# Altium schematic sheet 19_PWR_VRS.SchDoc
size A3; DocumentNumber: 19; SheetNumber: 19; SheetTotal: 21
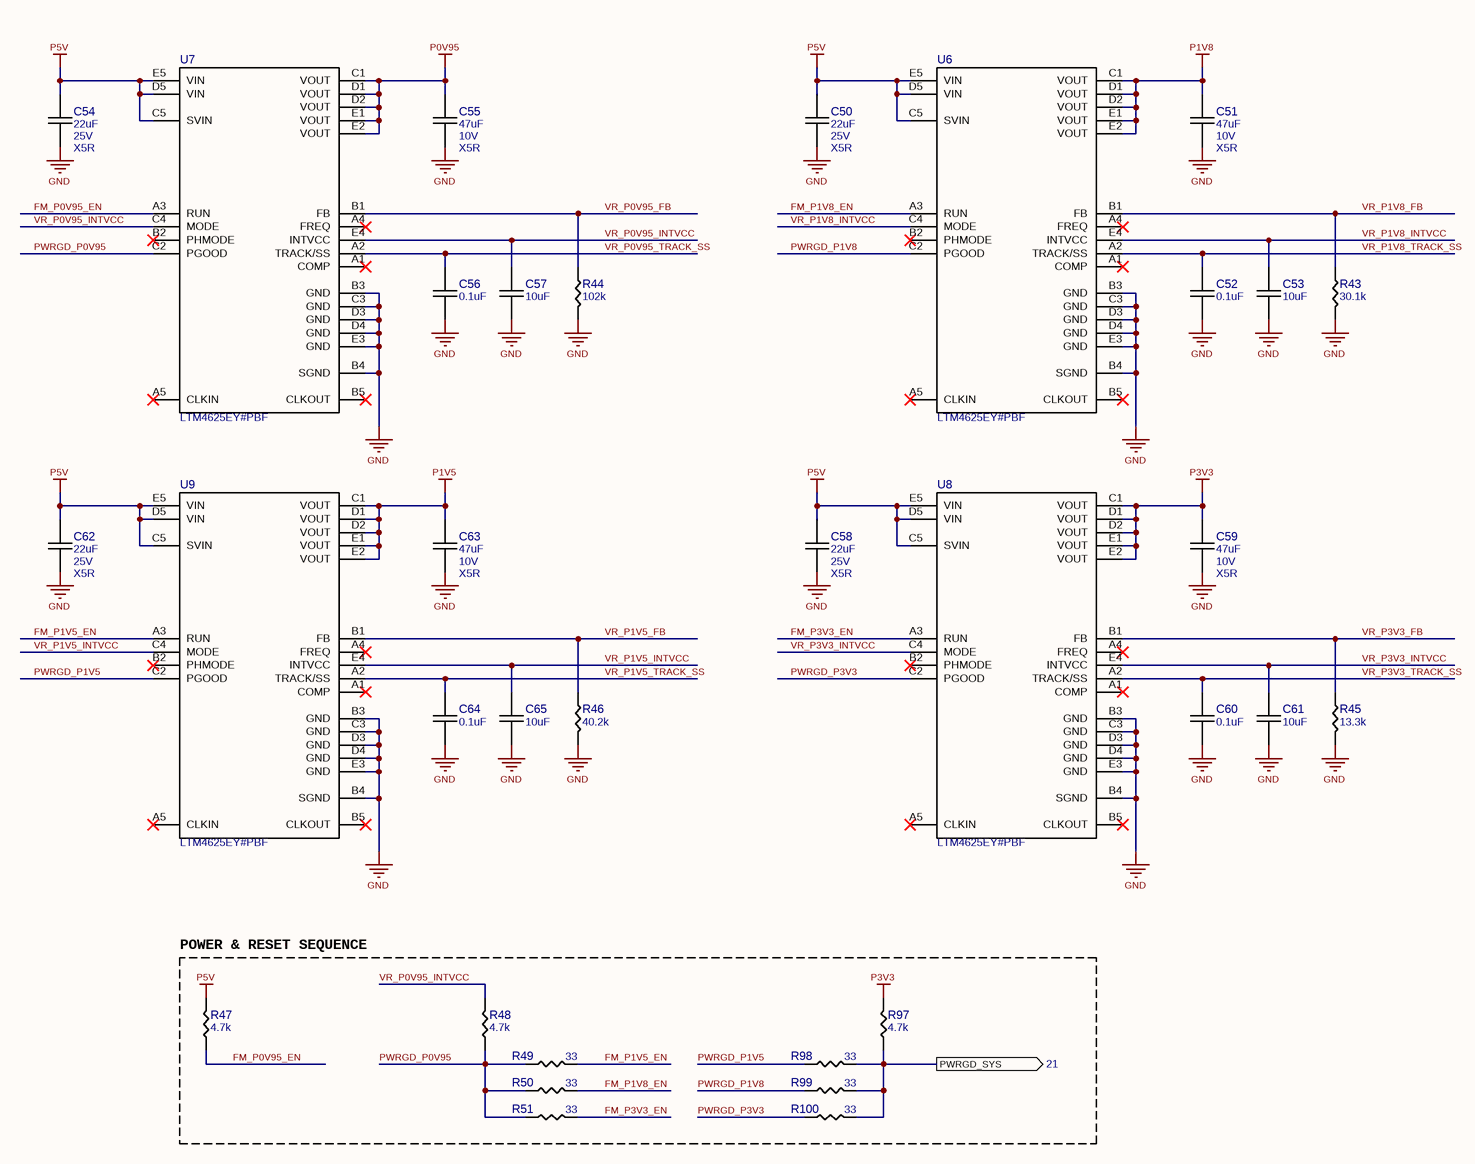
[diagram p0: 19_PWR_VRS.SchDoc]

## Parts
C50  22uF  Voltage: 25V  TempC: X5R  [CAPC2012X14N]
C51  47uF  Voltage: 10V  TempC: X5R  [CAPC2012X14N]
C52  0.1uF  [CAPC1005X06N]
C53  10uF  [CAPC1005X06N]
C54  22uF  Voltage: 25V  TempC: X5R  [CAPC2012X14N]
C55  47uF  Voltage: 10V  TempC: X5R  [CAPC2012X14N]
C56  0.1uF  [CAPC1005X06N]
C57  10uF  [CAPC1005X06N]
C58  22uF  Voltage: 25V  TempC: X5R  [CAPC2012X14N]
C59  47uF  Voltage: 10V  TempC: X5R  [CAPC2012X14N]
C60  0.1uF  [CAPC1005X06N]
C61  10uF  [CAPC1005X06N]
C62  22uF  Voltage: 25V  TempC: X5R  [CAPC2012X14N]
C63  47uF  Voltage: 10V  TempC: X5R  [CAPC2012X14N]
C64  0.1uF  [CAPC1005X06N]
C65  10uF  [CAPC1005X06N]
R43  30.1k  [RESC1005X03N]
R44  102k  [RESC1005X03N]
R45  13.3k  [RESC1005X03N]
R46  40.2k  [RESC1005X03N]
R47  4.7k  [RESC1005X03N]
R48  4.7k  [RESC1005X03N]
R49  33  [RESC1005X03N]
R50  33  [RESC1005X03N]
R51  33  [RESC1005X03N]
R97  4.7k  [RESC1005X03N]
R98  33  [RESC1005X03N]
R99  33  [RESC1005X03N]
R100  33  [RESC1005X03N]
U6  LTM4625EY#PBF  [BGA25C127P5X5_625X625X521]
U7  LTM4625EY#PBF  [BGA25C127P5X5_625X625X521]
U8  LTM4625EY#PBF  [BGA25C127P5X5_625X625X521]
U9  LTM4625EY#PBF  [BGA25C127P5X5_625X625X521]

## Blocks framed on the sheet
POWER & RESET SEQUENCE: R47-R51 R97-R100

## Ports
PWRGD_SYS (out, see 21)

## Nets
GND: C50.1 C51.1 C52.1 C53.1 C54.1 C55.1 C56.1 C57.1 C58.1 C59.1 C60.1 C61.1 C62.1 C63.1 C64.1 C65.1 R43.2 R44.2 R45.2 R46.2 U6.B3(GND) U6.B4(SGND) U6.C3(GND) U6.D3(GND) U6.D4(GND) U6.E3(GND) U7.B3(GND) U7.B4(SGND) U7.C3(GND) U7.D3(GND) U7.D4(GND) U7.E3(GND) U8.B3(GND) U8.B4(SGND) U8.C3(GND) U8.D3(GND) U8.D4(GND) U8.E3(GND) U9.B3(GND) U9.B4(SGND) U9.C3(GND) U9.D3(GND) U9.D4(GND) U9.E3(GND)
P0V95: C55.2 U7.C1(VOUT) U7.D1(VOUT) U7.D2(VOUT) U7.E1(VOUT) U7.E2(VOUT)
P1V5: C63.2 U9.C1(VOUT) U9.D1(VOUT) U9.D2(VOUT) U9.E1(VOUT) U9.E2(VOUT)
P1V8: C51.2 U6.C1(VOUT) U6.D1(VOUT) U6.D2(VOUT) U6.E1(VOUT) U6.E2(VOUT)
P3V3: C59.2 R97.2 U8.C1(VOUT) U8.D1(VOUT) U8.D2(VOUT) U8.E1(VOUT) U8.E2(VOUT)
P5V: C50.2 C54.2 C58.2 C62.2 R47.2 U6.C5(SVIN) U6.D5(VIN) U6.E5(VIN) U7.C5(SVIN) U7.D5(VIN) U7.E5(VIN) U8.C5(SVIN) U8.D5(VIN) U8.E5(VIN) U9.C5(SVIN) U9.D5(VIN) U9.E5(VIN)
FM_P0V95_EN: R47.1 U7.A3(RUN)
FM_P1V5_EN: R49.2 U9.A3(RUN)
FM_P1V8_EN: R50.2 U6.A3(RUN)
FM_P3V3_EN: R51.2 U8.A3(RUN)
PWRGD_P0V95: R48.1 R49.1 R50.1 R51.1 U7.C2(PGOOD)
PWRGD_P1V5: R98.1 U9.C2(PGOOD)
PWRGD_P1V8: R99.1 U6.C2(PGOOD)
PWRGD_P3V3: R100.1 U8.C2(PGOOD)
PWRGD_SYS: R97.1 R98.2 R99.2 R100.2 ; port PWRGD_SYS
VR_P0V95_FB: R44.1 U7.B1(FB)
VR_P0V95_INTVCC: C57.2 R48.2 U7.C4(MODE) U7.E4(INTVCC)
VR_P0V95_TRACK_SS: C56.2 U7.A2(TRACK/SS)
VR_P1V5_FB: R46.1 U9.B1(FB)
VR_P1V5_INTVCC: C65.2 U9.C4(MODE) U9.E4(INTVCC)
VR_P1V5_TRACK_SS: C64.2 U9.A2(TRACK/SS)
VR_P1V8_FB: R43.1 U6.B1(FB)
VR_P1V8_INTVCC: C53.2 U6.C4(MODE) U6.E4(INTVCC)
VR_P1V8_TRACK_SS: C52.2 U6.A2(TRACK/SS)
VR_P3V3_FB: R45.1 U8.B1(FB)
VR_P3V3_INTVCC: C61.2 U8.C4(MODE) U8.E4(INTVCC)
VR_P3V3_TRACK_SS: C60.2 U8.A2(TRACK/SS)

Not connected (* = marked no-connect by the designer): U6 A1(COMP)* A4(FREQ)* A5(CLKIN)* B2(PHMODE)* B5(CLKOUT)*; U7 A1(COMP)* A4(FREQ)* A5(CLKIN)* B2(PHMODE)* B5(CLKOUT)*; U8 A1(COMP)* A4(FREQ)* A5(CLKIN)* B2(PHMODE)* B5(CLKOUT)*; U9 A1(COMP)* A4(FREQ)* A5(CLKIN)* B2(PHMODE)* B5(CLKOUT)*

## Library data of the parts
C50 C54 C58 C62 = GRM21BR61E226ME44L: CAP CER 22UF 25V X5R 0805; Manufacturer 1: Murata Electronics; Tol: 20%; Part Number: GRM21BR61E226ME44L; Value: 22uF; Manufacturer Part Number 1: GRM21BR61E226ME44L; Supplier 1: Digi-Key; Supplier Part Number 1: 490-10749-1-ND
C51 C55 C59 C63 = GRM21BR61A476ME15L: CAP CER 47UF 10V X5R 0805; Manufacturer 1: Murata Electronics; Tol: 20%; Part Number: GRM21BR61A476ME15L; Value: 47uF; Manufacturer Part Number 1: GRM21BR61A476ME15L; Supplier 1: Digi-Key; Supplier Part Number 1: 490-9961-1-ND
C52 C56 C60 C64 = GRM155R71E104KE14J: CAP CER 0.1UF 25V X7R 0402; Manufacturer 1: Murata Electronics; Tol: 10%; Part Number: GRM155R71E104KE14J; Value: 0.1uF; Voltage: 25V; TempC: X7R; Manufacturer Part Number 1: GRM155R71E104KE14J; Supplier 1: Digi-Key; Supplier Part Number 1: 490-14603-1-ND
C53 C57 C61 C65 = GRM155R60J106ME47D: CAP CER 10UF 6.3V X5R 0402; Manufacturer 1: Murata Electronics; Tol: 20%; Part Number: GRM155R60J106ME47D; Value: 10uF; Voltage: 6.3V; TempC: X5R; Manufacturer Part Number 1: GRM155R60J106ME47D; Supplier 1: Digi-Key; Supplier Part Number 1: 490-13239-1-ND
R43 = RC0402FR-0730K1L: RES 30.1K OHM 1% 1/16W 0402; Manufacturer 1: Yageo; Part Number: RC0402FR-0730K1L; Value: 30.1k; Tol: 1%; Manufacturer Part Number 1: RC0402FR-0730K1L; Supplier 1: Digi-Key; Supplier Part Number 1: 311-30.1KLRCT-ND
R44 = RC0402FR-07102KL: RES SMD 102K OHM 1% 1/16W 0402; Manufacturer 1: Yageo; Part Number: RC0402FR-07102KL; Value: 102k; Tol: 1%; Manufacturer Part Number 1: RC0402FR-07102KL; Supplier 1: Digi-Key; Supplier Part Number 1: YAG2944CT-ND
R45 = RC0402FR-0713K3L: RES 13.3K OHM 1% 1/16W 0402; Manufacturer 1: Yageo; Part Number: RC0402FR-0713K3L; Value: 13.3k; Tol: 1%; Manufacturer Part Number 1: RC0402FR-0713K3L; Supplier 1: Digi-Key; Supplier Part Number 1: YAG2974CT-ND
R46 = RC0402FR-0740K2L: RES 40.2K OHM 1% 1/16W 0402; Manufacturer 1: Yageo; Part Number: RC0402FR-0740K2L; Value: 40.2k; Tol: 1%; Manufacturer Part Number 1: RC0402FR-0740K2L; Supplier 1: Digi-Key; Supplier Part Number 1: 311-40.2KLRCT-ND
R47 R48 R97 = RC0402FR-074K7L: RES SMD 4.7K OHM 1% 1/16W 0402; Manufacturer 1: Yageo; Part Number: RC0402FR-074K7L; Value: 4.7k; Tol: 1%; Manufacturer Part Number 1: RC0402FR-074K7L; Supplier 1: Digi-Key; Supplier Part Number 1: 311-4.7KLRCT-ND
R49-R51 R98-R100 = RC0402FR-0733RL: RES SMD 33 OHM 1% 1/16W 0402; Manufacturer 1: Yageo; Part Number: RC0402FR-0733RL; Value: 33; Tol: 1%; Manufacturer Part Number 1: RC0402FR-0733RL; Supplier 1: Digi-Key; Supplier Part Number 1: 311-33.0LRCT-ND
U6-U9 = LTM4625EY#PBF: DC DC CONVERTER 0.6-5.5V; Manufacturer 1: Analog Devices Inc.; Part Number: LTM4625EY#PBF; Manufacturer Part Number 1: LTM4625EY#PBF; Supplier 1: Digi-Key; Supplier Part Number 1: 505-LTM4625EY#PBF-ND